# Altium schematic sheet power.SchDoc
size A4
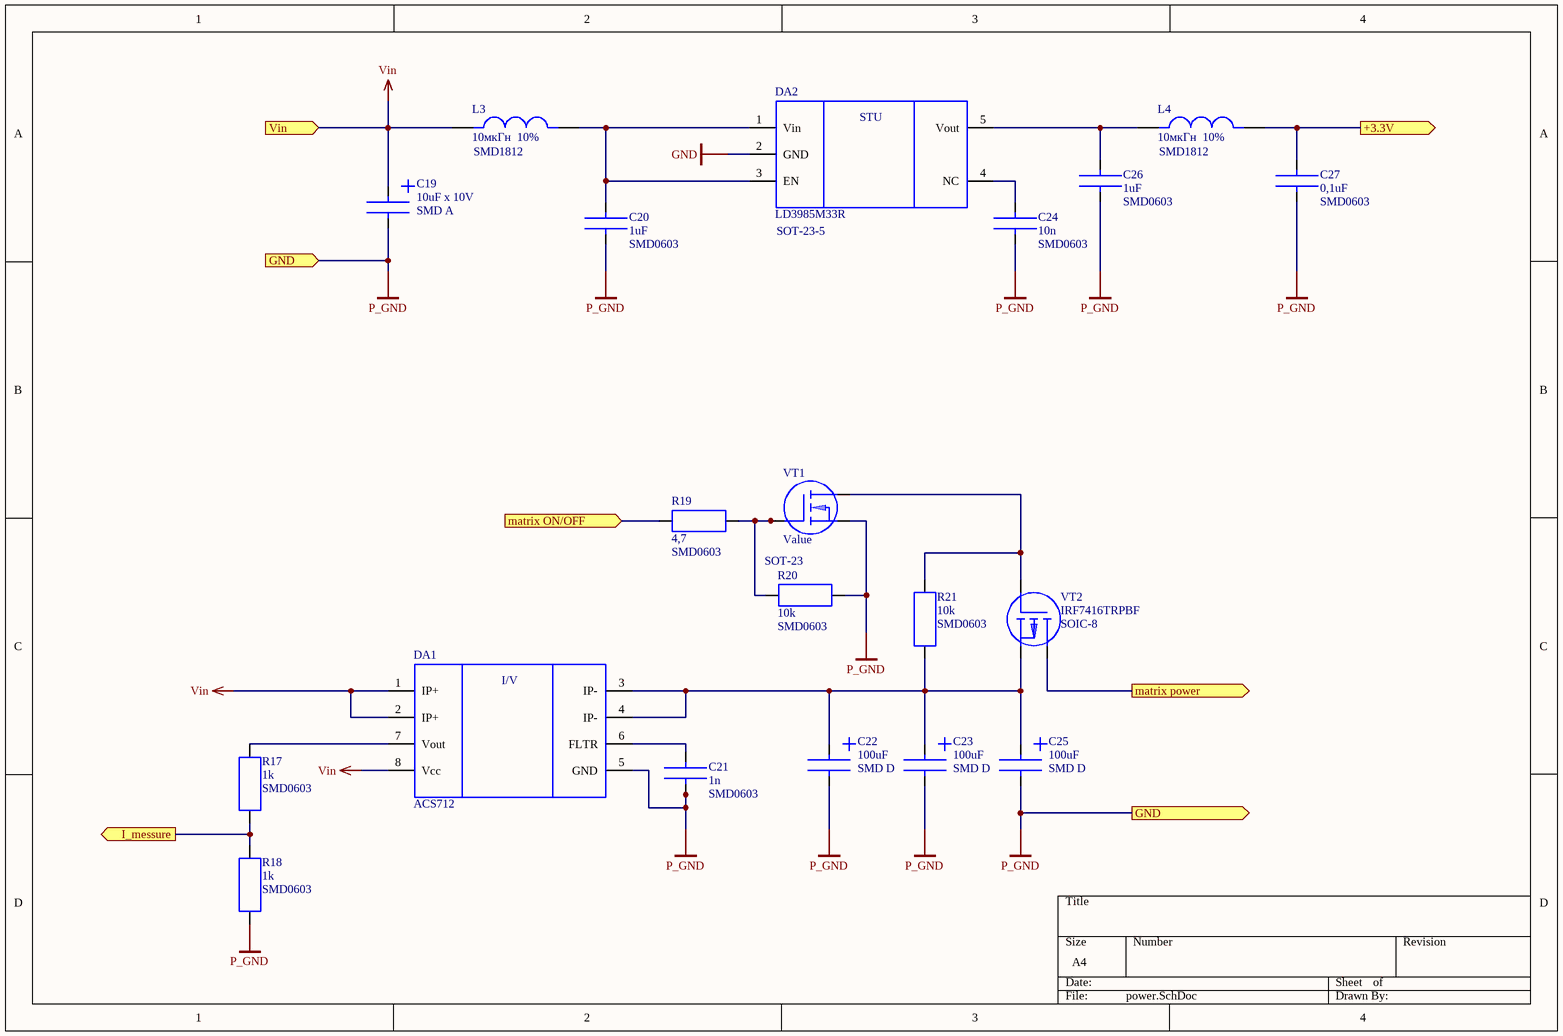
[diagram p0: power.SchDoc]

## Parts
C19  10uF x 10V  Package: SMD A  [TANT_CAP_A(3216)]
C20  1uF  Package: SMD0603  [SMD0603(1005)]
C21  1n  Package: SMD0603  [SMD0603(1005)]
C22  100uF  Package: SMD D  [TANT_CAP_D(7343)]
C23  100uF  Package: SMD D  [TANT_CAP_D(7343)]
C24  10n  Package: SMD0603  [SMD0603(1005)]
C25  100uF  Package: SMD D  [TANT_CAP_D(7343)]
C26  1uF  Package: SMD0603  [SMD0603(1005)]
C27  0,1uF  Package: SMD0603  [SMD0603(1005)]
DA1  ACS712  [SOIC8]
DA2  LD3985M33R  Package: SOT-23-5  [SOT23-5]
L3  10мкГн  10%  Package: SMD1812  [SMD2010(5025)]
L4  10мкГн  10%  Package: SMD1812  [SMD2010(5025)]
R17  1k  Package: SMD0603  [SMD0603(1005)]
R18  1k  Package: SMD0603  [SMD0603(1005)]
R19  4,7  Package: SMD0603  [SMD0603(1005)]
R20  10k  Package: SMD0603  [SMD0603(1005)]
R21  10k  Package: SMD0603  [SMD0603(1005)]
VT1  Value  Package: SOT-23  [SOT23-3]
VT2  IRF7416TRPBF  Package: SOIC-8  [VT_SOIC8]

## Ports
+3.3V (out), GND (in), GND (out), I_messure (out), matrix ON/OFF (in), matrix power (out), Vin (in)

## Nets
GND: DA2.2(GND)
P_GND: C19.2 C20.2 C21.2 C22.2 C23.2 C24.2 C25.2 C26.2 C27.2 DA1.5(GND) R18.2 R20.2 VT1.2 ; port GND
Vin: C19.1 DA1.1(IP+) DA1.2(IP+) DA1.8(Vcc) L3.1(IN1) ; port Vin
+3.3V: C27.1 L4.2(IN1) ; port +3.3V
I_messure: R17.2 R18.1 ; port I_messure
matrix ON/OFF: R19.1 ; port matrix ON/OFF
matrix power: VT2.3 ; port matrix power
NetC20_1: C20.1 DA2.1(Vin) DA2.3(EN) L3.2(IN1)
NetC21_1: C21.1 DA1.6(FLTR)
NetC22_1: C22.1 C23.1 C25.1 DA1.3(IP-) DA1.4(IP-) R21.2 VT2.1
NetC24_1: C24.1 DA2.4(NC)
NetC26_1: C26.1 DA2.5(Vout) L4.1(IN1)
NetDA1_7: DA1.7(Vout) R17.1
NetR19_2: R19.2 R20.1 VT1.1
NetR21_1: R21.1 VT1.3 VT2.2

## Notes on the sheet
- (in symbol LD3985M33R) STU
- (in symbol Микросхема ACS712) I/V

## Library data of the parts
C19 = C_TANT_A: Type: C; ValueBOM: Конденсатор танталовый 10мкФ х 10В SMD A; Value: 10uF x 10V
C20 C26 = CER_CUP_0603: Type: C; ValueBOM: Конденсатор керамический 1мкФ SMD 0603 1%; Value: 1uF
C21 = CER_CUP_0603: Type: C; ValueBOM: Конденсатор керамический 1нФ х 50В SMD 0603 1%; Value: 1n
C22 C23 C25 = C_TANT_D: Type: C; ValueBOM: Конденсатор танталовый 100мкФ х 16В 10%  SMD D; Value: 100uF
C24 = CER_CUP_0603: Type: C; ValueBOM: Конденсатор керамический 10нФ х 50В SMD 0603 1%; Value: 10n
C27 = CER_CUP_0603: Type: C; ValueBOM: Конденсатор керамический 0,1мкФ SMD 0603 1%; Value: 0,1uF
DA1 = Микросхема ACS712: Value: ACS712; Type: DA; ValueBOM: Микросхема ACS712
DA2 = LD3985M33R: ValueBOM: Микросхема LD3985M33R, SOT-23-5; Value: LD3985M33R; Type: DA
L3 L4 = L1: ValueBOM: Индуктивность B82432-C1103-K, 10 мкГн, SMD1812, 10%; Type: L; Value: 10мкГн  10%
R17 R18 = R_0603: ValueBOM: Резистор 1кОм SMD 0603 1%; Type: R; Value: 1k
R19 = R_0603: ValueBOM: Резистор 4,7Ом SMD 0603 1%; Type: R; Value: 4,7
R20 R21 = R_0603: ValueBOM: Резистор 10кОм SMD 0603 1%; Type: R; Value: 10k
VT1 = VT_N_MOSFET_SOT23_3: Type: VT; ValueBOM: Транзистор n-МОП Value SOT23; Value: Value
VT2 = Транзистор IRF7416TRPBF: Type: VT; ValueBOM: Транзистор p-МОП IRF7416TRPBF, SOIC-8; Value: IRF7416TRPBF